# Altium schematic sheet 05_Computer.SchDoc
size A4
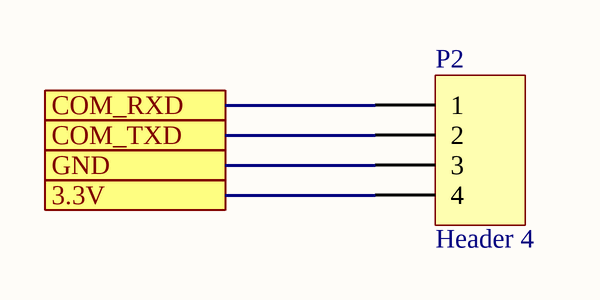
[diagram p0: 05_Computer.SchDoc]

## Parts
P2  Header 4  [HDR1X4]

## Ports
3.3V, COM_RXD, COM_TXD, GND

## Nets
3.3V: P2.4 ; port 3.3V
COM_RXD: P2.1 ; port COM_RXD
COM_TXD: P2.2 ; port COM_TXD
GND: P2.3 ; port GND

## Notes on the sheet
- Project:
- MANDevices
- Page Contents:
- Size:
- Date:
- A4
- Checked by:
- Time:
- Revision:
- Sheet
- of
- HaNoi University of
- Science and Technology
- File:

## Library data of the parts
P2 = Header 4: Header, 4-Pin; LatestRevisionDate: 17-Jul-2002; LatestRevisionNote: Re-released for DXP Platform.; Publisher: Altium Limited